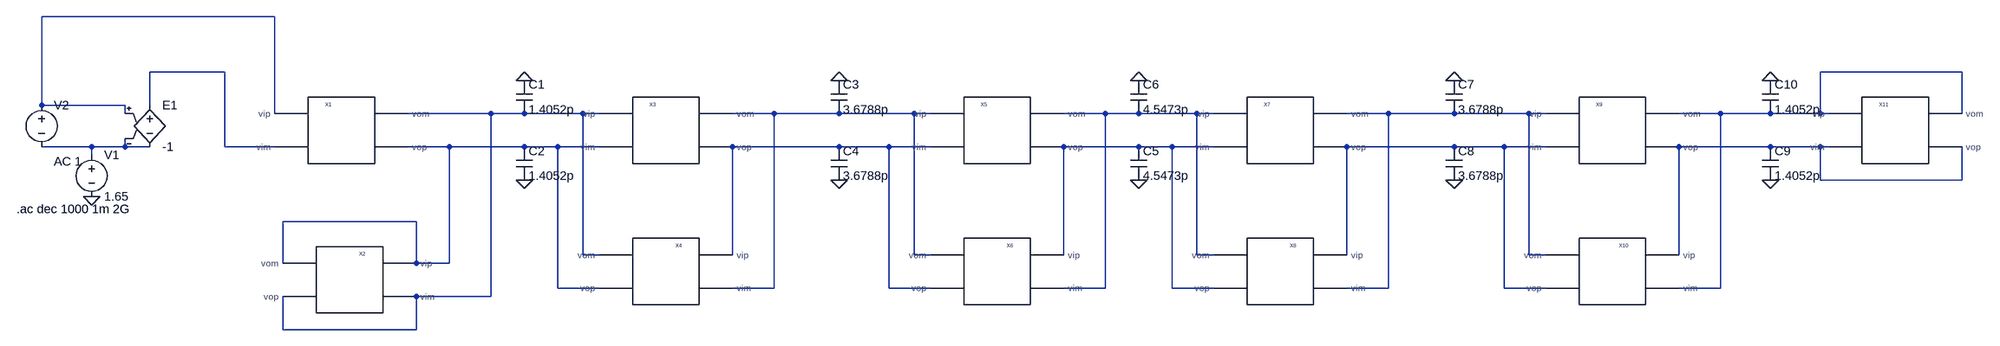
[diagram p0: schematic Fully Differential.asc]
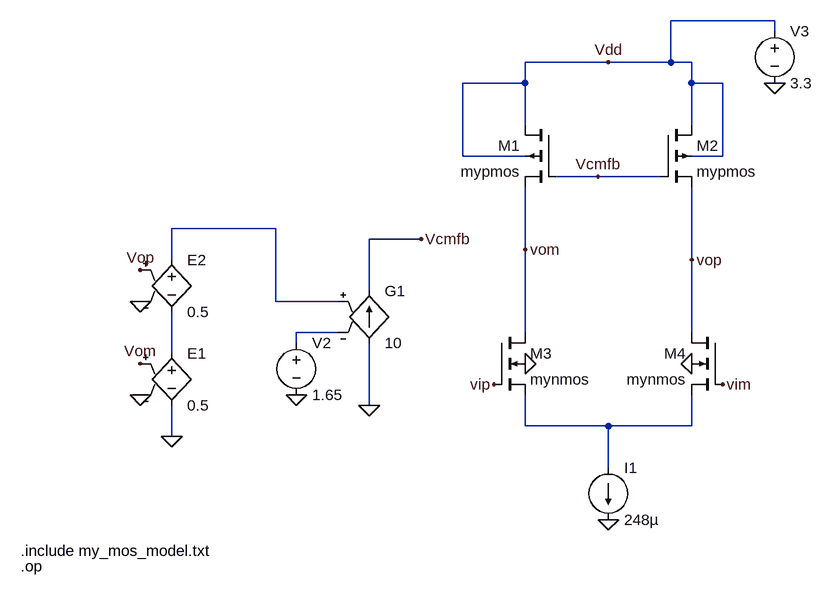
[diagram p1: sub-circuit transconductor.asc]
Fully Differential.asc, the LTspice schematic file:
Version 4
SHEET 1 3468 680
WIRE 64 -48 -384 -48
WIRE -32 64 -176 64
WIRE 3312 64 3040 64
WIRE -384 128 -384 -48
WIRE -224 128 -384 128
WIRE -176 128 -176 64
WIRE -224 144 -224 128
WIRE 64 144 64 -48
WIRE 480 144 320 144
WIRE 544 144 480 144
WIRE 656 144 544 144
WIRE 688 144 656 144
WIRE 1024 144 944 144
WIRE 1152 144 1024 144
WIRE 1296 144 1152 144
WIRE 1328 144 1296 144
WIRE 1664 144 1584 144
WIRE 1728 144 1664 144
WIRE 1840 144 1728 144
WIRE 1872 144 1840 144
WIRE 2208 144 2128 144
WIRE 2336 144 2208 144
WIRE 2480 144 2336 144
WIRE 2512 144 2480 144
WIRE 2848 144 2768 144
WIRE 2944 144 2848 144
WIRE 3040 144 3040 64
WIRE 3040 144 2944 144
WIRE 3056 144 3040 144
WIRE 3312 144 3312 64
WIRE -288 208 -384 208
WIRE -224 208 -224 192
WIRE -224 208 -288 208
WIRE -176 208 -224 208
WIRE -32 208 -32 64
WIRE 64 208 -32 208
WIRE 400 208 320 208
WIRE 544 208 400 208
WIRE 608 208 544 208
WIRE 688 208 608 208
WIRE 1152 208 944 208
WIRE 1248 208 1152 208
WIRE 1328 208 1248 208
WIRE 1728 208 1584 208
WIRE 1792 208 1728 208
WIRE 1872 208 1792 208
WIRE 2336 208 2128 208
WIRE 2432 208 2336 208
WIRE 2512 208 2432 208
WIRE 2944 208 2768 208
WIRE 3040 208 2944 208
WIRE 3056 208 3040 208
WIRE -288 224 -288 208
WIRE 3040 272 3040 208
WIRE 3312 272 3312 208
WIRE 3312 272 3040 272
WIRE 336 352 80 352
WIRE 656 416 656 144
WIRE 688 416 656 416
WIRE 944 416 944 208
WIRE 1296 416 1296 144
WIRE 1328 416 1296 416
WIRE 1584 416 1584 208
WIRE 1840 416 1840 144
WIRE 1872 416 1840 416
WIRE 2128 416 2128 208
WIRE 2480 416 2480 144
WIRE 2512 416 2480 416
WIRE 2768 416 2768 208
WIRE 80 432 80 352
WIRE 336 432 336 352
WIRE 400 432 400 208
WIRE 400 432 336 432
WIRE 608 480 608 208
WIRE 688 480 608 480
WIRE 1024 480 1024 144
WIRE 1024 480 944 480
WIRE 1248 480 1248 208
WIRE 1328 480 1248 480
WIRE 1664 480 1664 144
WIRE 1664 480 1584 480
WIRE 1792 480 1792 208
WIRE 1872 480 1792 480
WIRE 2208 480 2208 144
WIRE 2208 480 2128 480
WIRE 2432 480 2432 208
WIRE 2512 480 2432 480
WIRE 2848 480 2848 144
WIRE 2848 480 2768 480
WIRE 480 496 480 144
WIRE 480 496 336 496
WIRE 80 560 80 496
WIRE 336 560 336 496
WIRE 336 560 80 560
FLAG -288 304 0
FLAG 1152 272 0
FLAG 1152 80 0
FLAG 1728 272 0
FLAG 1728 80 0
FLAG 544 272 0
FLAG 544 80 0
FLAG 2336 272 0
FLAG 2336 80 0
FLAG 2944 272 0
FLAG 2944 80 0
SYMBOL transconductor 192 176 R0
SYMATTR InstName X1
SYMBOL voltage -288 208 R0
WINDOW 123 0 0 Left 0
WINDOW 39 0 0 Left 0
SYMATTR InstName V1
SYMATTR Value 1.65
SYMBOL voltage -384 112 R0
WINDOW 123 24 124 Left 2
WINDOW 39 0 0 Left 0
SYMATTR Value2 AC 1
SYMATTR InstName V2
SYMATTR Value ""
SYMBOL e -176 112 R0
SYMATTR InstName E1
SYMATTR Value -1
SYMBOL transconductor 208 464 M0
SYMATTR InstName X2
SYMBOL transconductor 816 176 R0
SYMATTR InstName X3
SYMBOL transconductor 816 448 M0
SYMATTR InstName X4
SYMBOL cap 1136 80 R0
SYMATTR InstName C3
SYMATTR Value 3.6788p
SYMBOL cap 1136 208 R0
SYMATTR InstName C4
SYMATTR Value 3.6788p
SYMBOL transconductor 1456 176 R0
SYMATTR InstName X5
SYMBOL transconductor 1456 448 M0
SYMATTR InstName X6
SYMBOL cap 1712 208 R0
SYMATTR InstName C5
SYMATTR Value 4.5473p
SYMBOL cap 1712 80 R0
SYMATTR InstName C6
SYMATTR Value 4.5473p
SYMBOL cap 528 80 R0
SYMATTR InstName C1
SYMATTR Value 1.4052p
SYMBOL cap 528 208 R0
SYMATTR InstName C2
SYMATTR Value 1.4052p
SYMBOL transconductor 2000 176 R0
SYMATTR InstName X7
SYMBOL transconductor 2000 448 M0
SYMATTR InstName X8
SYMBOL cap 2320 80 R0
SYMATTR InstName C7
SYMATTR Value 3.6788p
SYMBOL cap 2320 208 R0
SYMATTR InstName C8
SYMATTR Value 3.6788p
SYMBOL transconductor 2640 176 R0
SYMATTR InstName X9
SYMBOL transconductor 2640 448 M0
SYMATTR InstName X10
SYMBOL cap 2928 208 R0
SYMATTR InstName C9
SYMATTR Value 1.4052p
SYMBOL cap 2928 80 R0
SYMATTR InstName C10
SYMATTR Value 1.4052p
SYMBOL transconductor 3184 176 R0
SYMATTR InstName X11
TEXT -432 328 Left 2 !.ac dec 1000 1m 2G

transconductor.asc, the sub-circuit schematic file:
Version 4
SHEET 1 1412 680
WIRE 528 -368 368 -368
WIRE 528 -352 528 -368
WIRE 272 -304 144 -304
WIRE 368 -304 368 -368
WIRE 368 -304 272 -304
WIRE 400 -304 368 -304
WIRE 144 -272 144 -304
WIRE 144 -272 48 -272
WIRE 400 -272 400 -304
WIRE 448 -272 400 -272
WIRE 144 -208 144 -272
WIRE 400 -208 400 -272
WIRE 48 -160 48 -272
WIRE 144 -160 48 -160
WIRE 448 -160 448 -272
WIRE 448 -160 400 -160
WIRE 256 -128 192 -128
WIRE 352 -128 256 -128
WIRE -240 -48 -400 -48
WIRE -16 -32 -96 -32
WIRE 144 -16 144 -112
WIRE -400 0 -400 -48
WIRE 400 0 400 -112
WIRE -96 48 -96 -32
WIRE -240 64 -240 -48
WIRE -144 64 -240 64
WIRE -144 112 -208 112
WIRE 144 112 144 -16
WIRE 400 112 400 0
WIRE -208 128 -208 112
WIRE -400 144 -400 80
WIRE -96 224 -96 128
WIRE 144 256 144 208
WIRE 272 256 144 256
WIRE 400 256 400 208
WIRE 400 256 272 256
WIRE -400 272 -400 224
WIRE 272 320 272 256
FLAG 272 -304 Vdd
FLAG 400 0 vop
FLAG 144 -16 vom
FLAG 96 192 vip
FLAG 448 192 vim
FLAG -448 208 0
FLAG -448 64 0
FLAG -448 16 Vop
FLAG -448 160 Vom
FLAG -400 272 0
FLAG -96 224 0
FLAG -16 -32 Vcmfb
FLAG 256 -128 Vcmfb
FLAG 528 -272 0
FLAG 144 160 0
FLAG 400 160 0
FLAG 272 400 0
FLAG -208 208 0
SYMBOL nmos4 96 112 R0
SYMATTR InstName M3
SYMATTR Value mynmos
SYMATTR Value2 l=0.5u w=3.37u m=4
SYMBOL nmos4 448 112 M0
SYMATTR InstName M4
SYMATTR Value mynmos
SYMATTR Value2 l=0.5u w=3.37u m=4
SYMBOL pmos4 192 -208 M0
SYMATTR InstName M1
SYMATTR Value mypmos
SYMATTR Value2 l=0.5u w=3.37u m=14
SYMBOL pmos4 352 -208 R0
SYMATTR InstName M2
SYMATTR Value mypmos
SYMATTR Value2 l=0.5u w=3.37u m=14
SYMBOL e -400 128 R0
SYMATTR InstName E1
SYMATTR Value 0.5
SYMBOL e -400 -16 R0
SYMATTR InstName E2
SYMATTR Value 0.5
SYMBOL voltage 528 -368 R0
WINDOW 123 0 0 Left 0
WINDOW 39 0 0 Left 0
SYMATTR InstName V3
SYMATTR Value 3.3
SYMBOL current 272 320 R0
WINDOW 123 0 0 Left 0
WINDOW 39 0 0 Left 0
SYMATTR InstName I1
SYMATTR Value 248µ
SYMBOL g -96 32 R0
SYMATTR InstName G1
SYMATTR Value 10
SYMBOL voltage -208 112 R0
WINDOW 123 0 0 Left 0
WINDOW 39 0 0 Left 0
SYMATTR InstName V2
SYMATTR Value 1.65
TEXT -632 448 Left 2 !.include my_mos_model.txt
TEXT -632 472 Left 2 !.op

The netlist it stands for:
* Fully Differential.asc
XX1 N001 N002 N004 N009 transconductor params: transconductor
V1 N008 0 1.65
V2 N001 N008 AC 1
E1 N002 N008 N001 N008 -1
XX2 N009 N004 N009 N004 transconductor params: transconductor
XX3 N004 N009 N005 N010 transconductor params: transconductor
XX4 N010 N005 N004 N009 transconductor params: transconductor
C3 0 N005 3.6788p
C4 N010 0 3.6788p
XX5 N005 N010 N006 N011 transconductor params: transconductor
XX6 N011 N006 N005 N010 transconductor params: transconductor
C5 N011 0 4.5473p
C6 0 N006 4.5473p
C1 0 N004 1.4052p
C2 N009 0 1.4052p
XX7 N006 N011 N007 N012 transconductor params: transconductor
XX8 N012 N007 N006 N011 transconductor params: transconductor
C7 0 N007 3.6788p
C8 N012 0 3.6788p
XX9 N007 N012 N003 N013 transconductor params: transconductor
XX10 N013 N003 N007 N012 transconductor params: transconductor
C9 N013 0 1.4052p
C10 0 N003 1.4052p
XX11 N003 N013 N003 N013 transconductor params: transconductor

* block symbol definitions
.subckt transconductor vip vim vom vop
M3 vom vip N004 0 mynmos l=0.5u w=3.37u m=4
M4 vop vim N004 0 mynmos l=0.5u w=3.37u m=4
M1 Vdd Vcmfb vom Vdd mypmos l=0.5u w=3.37u m=14
M2 Vdd Vcmfb vop Vdd mypmos l=0.5u w=3.37u m=14
E1 N003 0 vom 0 0.5
E2 N001 N003 vop 0 0.5
V3 Vdd 0 3.3
I1 N004 0 248µ
G1 0 Vcmfb N001 N002 10
V2 N002 0 1.65
.include my_mos_model.txt
.op
.ends transconductor

.model NMOS NMOS
.model PMOS PMOS
.lib standard.mos
.ac dec 1000 1m 2G
.backanno
.end